# Altium schematic sheet Chip_Inputs.SchDoc
size A4; SheetNumber: 3; SheetTotal: 4
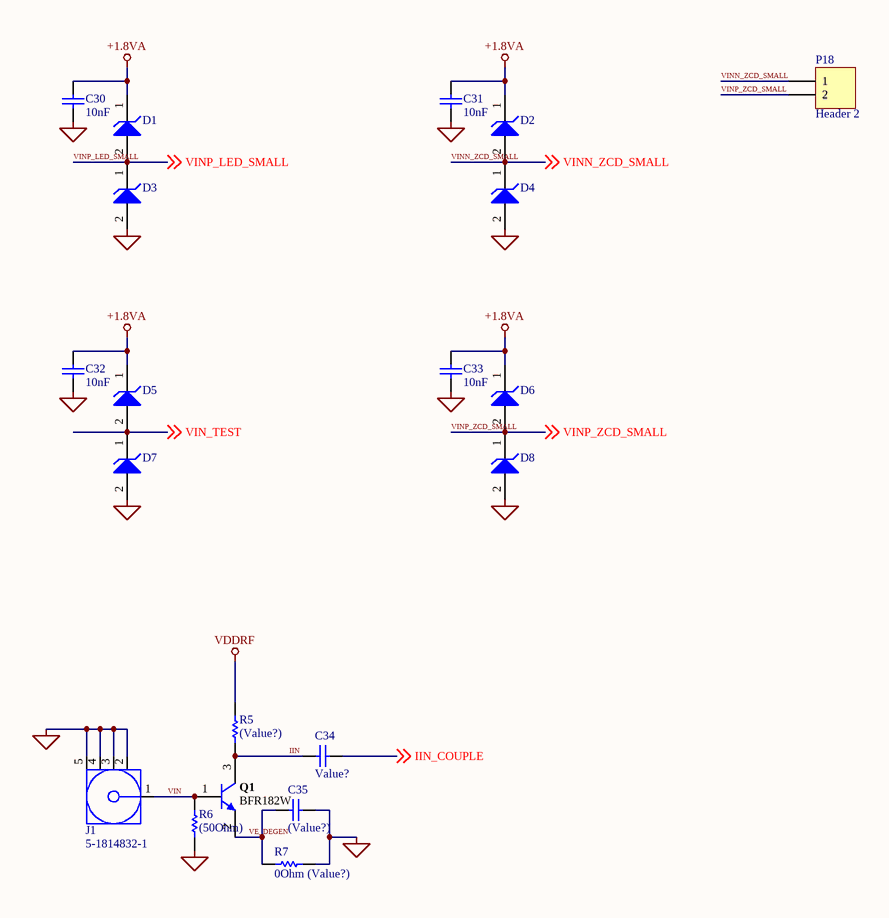
[diagram p0: Chip_Inputs.SchDoc]

## Parts
C30  10nF  [CAPC1608X90X35ML10T15]
C31  10nF  [CAPC1608X90X35ML10T15]
C32  10nF  [CAPC1608X90X35ML10T15]
C33  10nF  [CAPC1608X90X35ML10T15]
C34  Value?  [CAPC1608X90X35ML10T15]
C35  (Value?)  [CAPC1608X90X35ML10T15]
D1  (no value)  [ONSC-SOD-123-2-425-04_V]
D2  (no value)  [ONSC-SOD-123-2-425-04_V]
D3  (no value)  [ONSC-SOD-123-2-425-04_V]
D4  (no value)  [ONSC-SOD-123-2-425-04_V]
D5  (no value)  [ONSC-SOD-123-2-425-04_V]
D6  (no value)  [ONSC-SOD-123-2-425-04_V]
D7  (no value)  [ONSC-SOD-123-2-425-04_V]
D8  (no value)  [ONSC-SOD-123-2-425-04_V]
J1  5-1814832-1  [TECO-5-1814832-1_V]
P18  Header 2  [HDR1X2]
Q1  BFR182W  [INF-SOT323_L]
R5  (Value?)  [RESC1609X50X30NL8T20]
R6  (50Ohm)  [RESC1609X50X30NL8T20]
R7  0Ohm (Value?)  [RESC1609X50X30NL8T20]

## Nets
+1.8VA: C30.2 C31.2 C32.2 C33.2 D1.1(K) D2.1(K) D5.1(K) D6.1(K)
GND: C30.1 C31.1 C32.1 C33.1 C35.1 D3.2(A) D4.2(A) D7.2(A) D8.2(A) J1.2 J1.3 J1.4 J1.5 R6.1 R7.1
VDDRF: R5.2
IIN: C34.2 Q1.3(C) R5.1
IIN_COUPLE: C34.1 ; off-sheet IIN_COUPLE
VE_DEGEN: C35.2 Q1.2(E) R7.2
VIN: J1.1 Q1.1(B) R6.2
VIN_TEST: D5.2(A) D7.1(K) ; off-sheet VIN_TEST
VINN_ZCD_SMALL: D2.2(A) D4.1(K) P18.1 ; off-sheet VINN_ZCD_SMALL
VINP_LED_SMALL: D1.2(A) D3.1(K) ; off-sheet VINP_LED_SMALL
VINP_ZCD_SMALL: D6.2(A) D8.1(K) P18.2 ; off-sheet VINP_ZCD_SMALL

## Library data of the parts
C30-C35 = CMP-2000-04945-1: 0603; Manufacturer: Murata; Capacitance: 22pF; Tolerance (%): ±5%; Rated Voltage: 50V; Dielectric: C0G; Manufacturer URL: http://www.murata.com/; Datasheet Version: Jul-06; Package Reference: 603; Case Size/Dimension: 0603; Package Description: 2-Pin Surface Mount Device, Body 1.6 x 0.8 mm; Datasheet URL: https://datasheet.ciiva.com/11786/0900766b807a1cab-11786398.pdf
D1-D8 = CMP-1060-00509-1: Zener Voltage Regulator, 2-Pin SOD-123, Pb-Free, Tape and Reel; Manufacturer: On Semiconductor; PartNumber: MMSZ4679T1G; P Max (W): 0.5; VZ Typ (V): 2; Packing: Tape and Reel; ComponentLink1Description: Manufacturer URL; DatasheetVersion: Rev. 9; PackageReference: SOD-123-2-425-04; ComponentLink3URL: http://www.onsemi.com/pub_link/Collateral/425-04.PDF; PackageDescription: 2-Pin SOD, Body 1.6 x 2.69 mm; ComponentLink3Description: Package Specification; ComponentLink2Description: Datasheet; ComponentLink1URL: http://www.onsemi.com/; RoHS: Pb-Free; PackageVersion: Rev. G, 10/2009; ComponentLink2URL: http://www.onsemi.com/pub_link/Collateral/MMSZ4678T1-D.PDF; Mounting Technology: Surface Mount
J1 = CMP-2000-05415-1: SMA Connector, Pitch 5.08 mm, 1 Position, Height 9.5 mm, Tail Length 4 mm, -65 to 165 degC, RoHS, Bulk; Manufacturer: TE Connectivity; Connector Mounting: PCBMount; Connector Body Style: StraightJack; Impedance: 50ohm; Coaxial Termination: Solder; SVHC: NoSVHC(15-Jun-2015); Frequency Max: 3GHz; Product Range: ZDCSeries; Connector Type: SMACoaxial; Datasheet Version: Rev. B1, 03/2011; Package Reference: 5-1814832-1; Package Description: SMA Connector, Pitch 5.08 mm, 1 Position, Height 9.5 mm, Tail Length 4 mm; Contact Plating: GoldPlatedContacts; Coaxial Cable Types: -; Contact Material: BerylliumCopper; Manufacturer URL: http://www.te.com/; Datasheet URL: http://www.onlinecomponents.com/productFiles/mf-AMP/eng_cd_1814832_a.pdf
P18 = Header 2: Header, 2-Pin; LatestRevisionDate: 17-Jul-2002; LatestRevisionNote: Re-released for DXP Platform.; Publisher: Altium Limited
Q1 = CMP-1191-00013-1: NPN Silicon RF Transistor, 12 V VCEO, 35 mA IC, 19 dB Gmax, SOT323, Green; Manufacturer: Infineon; Ptot (max): 250mW; Green: yes; Gmax (typ): 19 dB; IC (max): 35 mA; NFmin (typ): 0.9 dB; VCEO (max): 12 V; Group: For low frequencies e.g. VHF/UHF; ComponentLink1Description: Manufacturer URL; PackageReference: SOT323; DatasheetVersion: Apr-2010; PackageDescription: 3-Pin Small Outline Transistor Package, 1.25 x 2 mm Body, 0.65 mm Pitch; Mounting Technology: Surface Mount; ComponentLink2URL: http://www.infineon.com/dgdl/bfr182w.pdf?folderId=db3a30431400ef68011425b1354605c1&fileId=db3a30431400ef680114269d1e43064c&location=en.Products.RF.RF_Transistors_.Low_Noise_Si_Transistors_up_to_2_5_GHz.DATASHEET.bfr182w.pdf; ComponentLink3Description: Package Specification; PartNumber: BFR182W; Halogen-free: yes; ComponentLink1URL: http://www.infineon.com/; ComponentLink2Description: Datasheet; ComponentLink3URL: http://www.infineon.com/dgdl/SOT323-Package_Overview.pdf?folderId=db3a30431936bc4b0119533e1dcb3c92&fileId=db3a30431936bc4b011953495f283cb1
R5-R7 = CMP-2000-03816-5: Chip Resistor, 0 Ohm, Jumper, 100 mW, -55 to 155 degC, 0603 (1608 Metric), RoHS, Tape and Reel; Manufacturer: Vishay Semiconductor; Voltage Rating: 75 V; Package Quantity: 5000; DatasheetVersion: 06/2012; Min Operating Temperature: -55 degC; ComponentLink1URL: http://www.vishay.com/; Mounting Technology: Surface Mount; Height: 0.45 mm; ComponentLink1Description: Manufacturer URL; REACH SVHC: Unknown; PackageReference: 0603; Packaging: Tape and Reel; Max Operating Temperature: 155 degC; Mount: Surface Mount; ComponentLink2Description: Datasheet; PackageDescription: 2-Pin Surface Mount Device, Body 1.575 x 0.85 mm; Length: 1.55 mm; ComponentLink2URL: http://www.vishay.com/docs/20035/dcrcwe3.pdf; Pins: 2; RoHSCompliant: true